# EAGLE design AND gate (EAGLE 6.5.0)
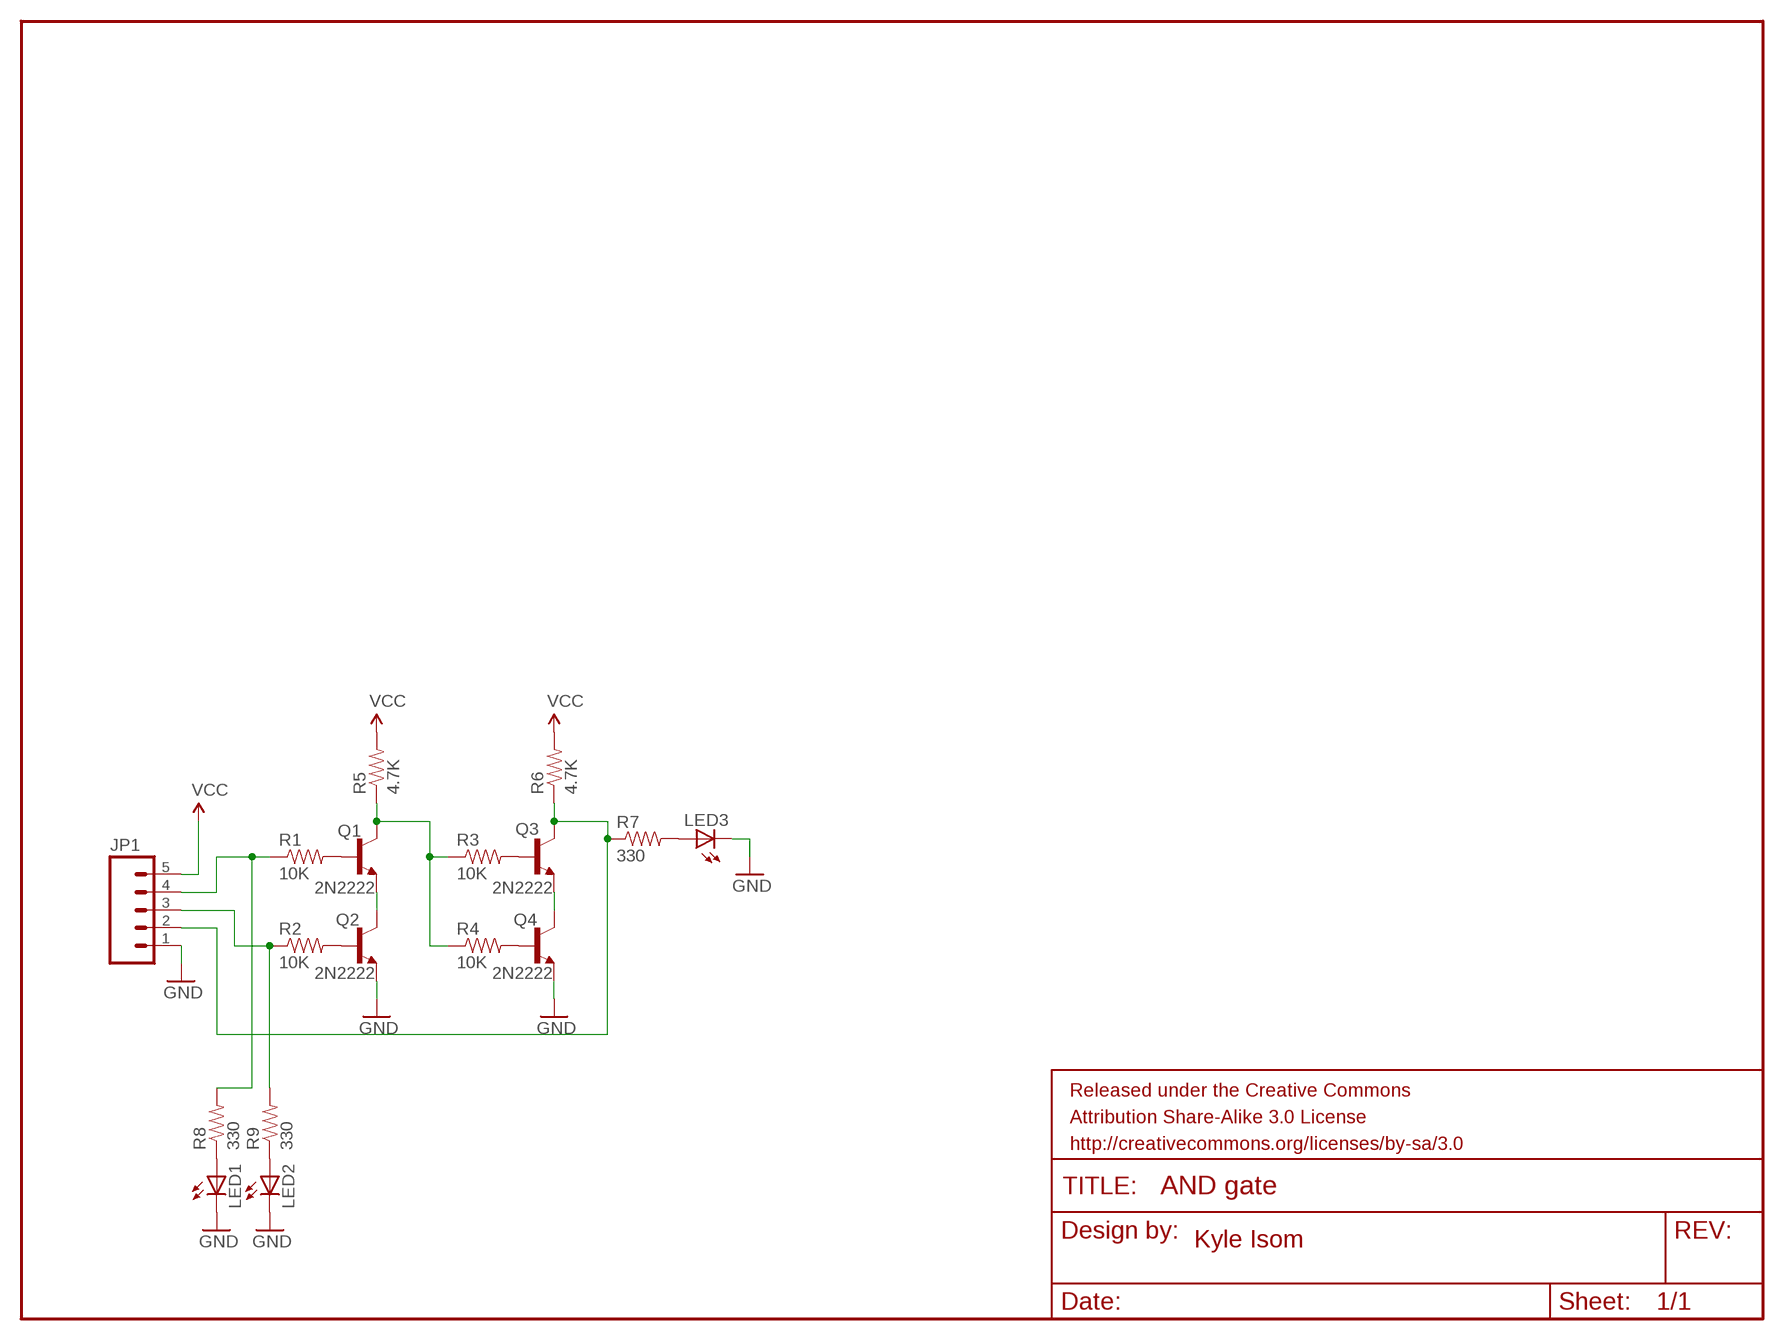
[diagram p0: schematic, sheet 1]

## Parts
FRAME1  FRAME-LETTER  [CREATIVE_COMMONS]
JP1  M05LOCK  [1X05_LOCK]
LED1  LED3MM  [LED3MM]
LED2  LED3MM  [LED3MM]
LED3  LED3MM  [LED3MM]
Q1  2N2222  TRANSISTOR_NPNTO-92-AMMO  [TO-92-AMMO]
Q2  2N2222  TRANSISTOR_NPNTO-92-AMMO  [TO-92-AMMO]
Q3  2N2222  TRANSISTOR_NPNTO-92-AMMO  [TO-92-AMMO]
Q4  2N2222  TRANSISTOR_NPNTO-92-AMMO  [TO-92-AMMO]
R1  10K  RESISTORPTH-1/4W  [AXIAL-0.4]
R2  10K  RESISTORPTH-1/4W  [AXIAL-0.4]
R3  10K  RESISTORPTH-1/4W  [AXIAL-0.4]
R4  10K  RESISTORPTH-1/4W  [AXIAL-0.4]
R5  4.7K  RESISTORPTH-1/4W  [AXIAL-0.4]
R6  4.7K  RESISTORPTH-1/4W  [AXIAL-0.4]
R7  330  RESISTORPTH-1/4W  [AXIAL-0.4]
R8  330  RESISTORPTH-1/4W  [AXIAL-0.4]
R9  330  RESISTORPTH-1/4W  [AXIAL-0.4]

## Nets
GND: JP1.1 LED1.K(C) LED2.K(C) LED3.K(C) Q2.1(E) Q4.1(E)
N$1: Q1.2(B) R1.P$2
N$2: Q2.2(B) R2.P$2
N$3: Q3.2(B) R3.P$2
N$4: Q4.2(B) R4.P$2
N$6: JP1.2 Q3.3(C) R6.P$1 R7.P$1
N$7: JP1.4 R1.P$1 R8.P$2
N$8: JP1.3 R2.P$1 R9.P$2
N$9: Q1.3(C) R3.P$1 R4.P$1 R5.P$1
N$10: Q1.1(E) Q2.3(C)
N$11: Q3.1(E) Q4.3(C)
N$13: LED3.A R7.P$2
N$14: LED1.A R8.P$1
N$15: LED2.A R9.P$1
VCC: JP1.5 R5.P$2 R6.P$2

## Notes on the sheet
- Kyle Isom

## Library data of the parts
FRAME1 = SparkFun-Aesthetics:FRAME-LETTER: Schematic Frame Standard 8.5x11 US Letter frame
JP1 = SparkFun-Connectors:M05: Header 5 Standard 5-pin 0.1" header. Use with straight break away headers (SKU : PRT-00116), right angle break away headers (PRT-00553), swiss pins (PRT-00743), machine pins (PRT-00117), and female headers (PRT-00115). Molex polarized connector foot print use with SKU : PRT-08230 with associated crimp pins and housings.
LED1-LED3 = SparkFun-LED:LED: LEDs Standard schematic elements and footprints for 5mm, 3mm, 1206, and 0603 sized LEDs. 5mm - Spark Fun Electronics SKU : COM-00529 (and others)
Q1-Q4 = SparkFun-DiscreteSemi:TRANSISTOR_NPN: Generic NPN BJT MMBT2222A - TRANS-08049 (SOT-23, 1A 40V) MPSA42 - TRANS-09116 (SOT-23, 500mA 300V) MMBT5088LT1G - TRANS-11160 (SOT-23, 50 mA 30V)
R1-R9 = SparkFun-Passives:RESISTOR: Resistor Basic schematic elements and footprints for 0603, 1206, and PTH resistors.

## Board
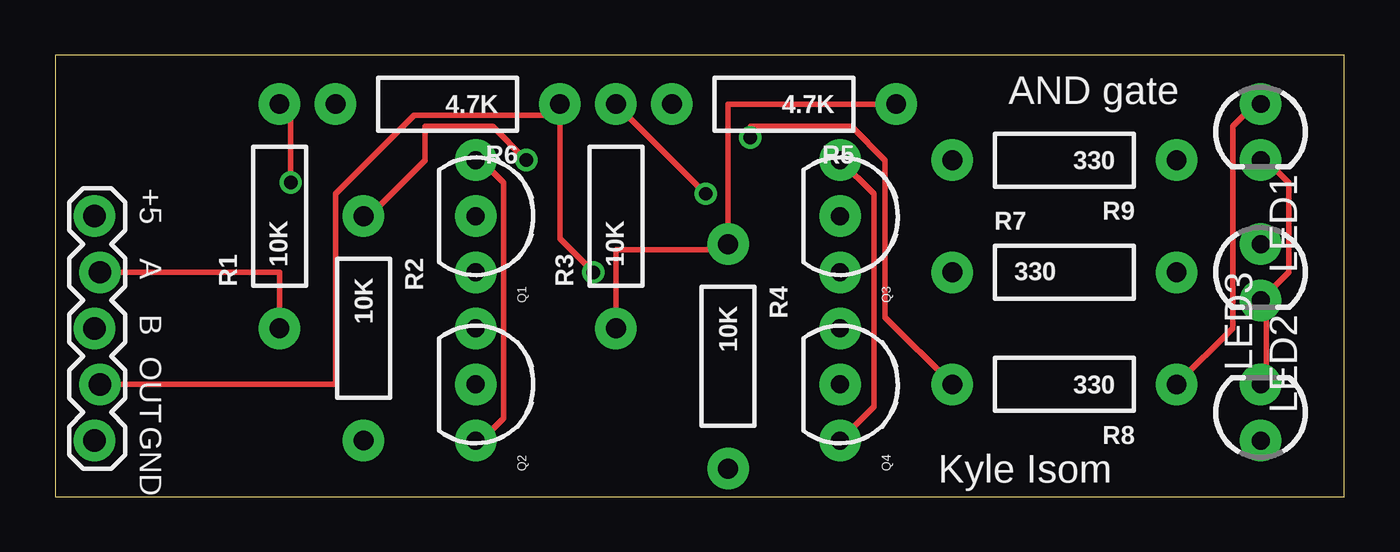
[diagram p1: board, top side]
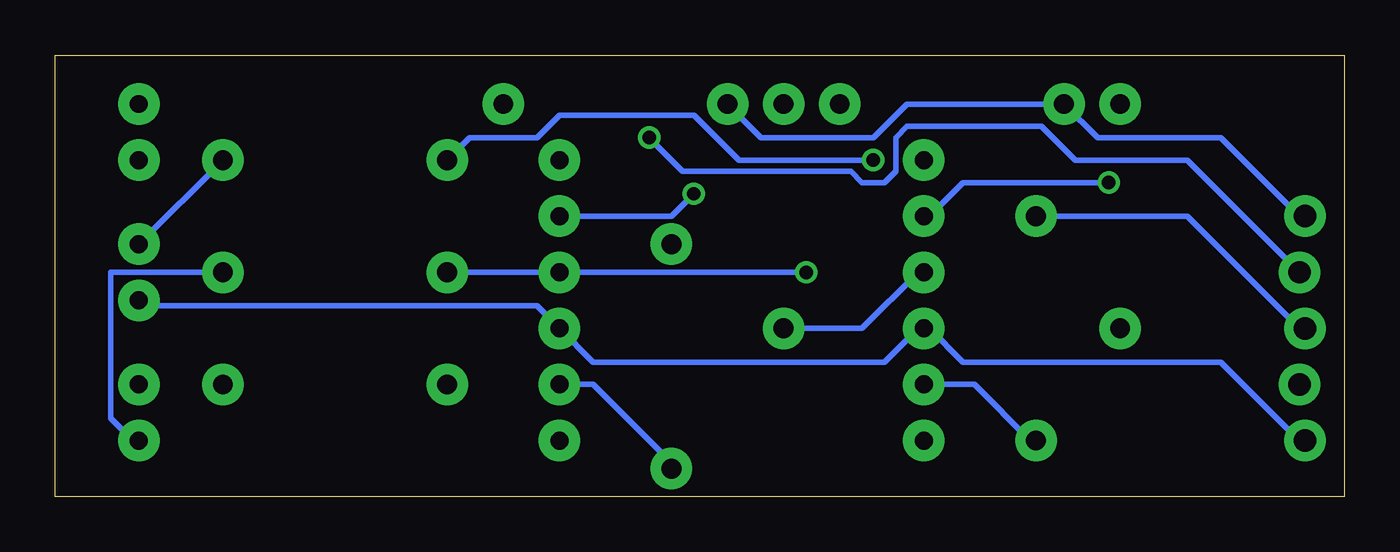
[diagram p2: board, bottom side, seen from below]

Size 58.4 x 19.99 mm. Coordinates in mm from the lower left corner, seen from the top.
Outline: 0,0 58.4,0 58.4,19.99 0,19.99 0,0
Copper layers (1*16): Top 0.035mm / dielectric 1.5mm / Bottom 0.035mm
Design rules "default": minimum track width 10mil, minimum drill 24mil, track to track 8mil, track to pad 8mil, pad to pad 8mil, via to via 8mil, smd to smd 8mil, copper to edge 40mil, drill to drill 8mil, minimum pad ring 10mil, minimum via ring 8mil, stop-mask expansion 4mil, vias tented up to drill 0mil, thermal gap 10mil

### Footprints (pad centres in the part's own frame; a part is rotated, then mirrored left to right if it is on the bottom)
1X05_LOCK = drill 1.016 pad 1.88: 1 0,0.127; 2 2.54,-0.127; 3 5.08,0.127; 4 7.62,-0.127; 5 10.16,0.127
LED3MM = drill 0.813 pad 1.88: A -1.27,0; K 1.27,0
TO-92-AMMO = drill 0.813 pad 1.88: 1 -2.54,0; 2 0,0; 3 2.54,0
AXIAL-0.4 = drill 0.9 pad 1.88: P$1 -5.08,0; P$2 5.08,0

### Placement (x,y rotation side)
FRAME1  21.59,-8.89 0 top  (outside the outline)
JP1  1.91,2.54 90 top
LED1  54.61,16.51 270 top
LED2  54.61,10.16 270 top
LED3  54.61,3.81 90 top
Q1  19.05,12.7 270 top
Q2  19.05,5.08 270 top
Q3  35.56,12.7 270 top
Q4  35.56,5.08 270 top
R1  10.16,12.7 90 top
R2  13.97,7.62 270 top
R3  25.4,12.7 90 top
R4  30.48,6.35 270 top
R5  33.02,17.78 180 top
R6  17.78,17.78 180 top
R7  45.72,10.16 0 top
R8  45.72,5.08 180 top
R9  45.72,15.24 180 top

### Tracks (layer width: path | path; a pad name or v marks a point on that pad's centre or on a via)
GND
  Top 0.254: LED3.K 54.86,5.08 54.86,8.64 LED2.K 55.88,10.16 55.88,14.22 54.86,15.24 LED1.K
  Bottom 0.254: LED2.K 54.36,8.64 36.58,8.64 Q4.1 34.04,6.1 20.83,6.1 19.3,7.62 Q2.1 18.8,7.62 17.27,6.1 5.59,6.1 2.03,2.54 JP1.1
N$1  (via drill 0.61)
  Top 0.254: R1.P$2 10.67,17.27 v10.67,14.22
  Bottom 0.254: v10.67,14.22 17.27,14.22 18.8,12.7 Q1.2
N$2
  Bottom 0.254: Q2.2 16.76,5.08 14.22,2.54 R2.P$2
N$3  (via drill 0.61)
  Top 0.254: v29.46,13.72 R3.P$2
  Bottom 0.254: v29.46,13.72 30.48,12.7 Q3.2
N$4
  Bottom 0.254: Q4.2 34.04,5.08 30.48,1.52 R4.P$2
N$6  (via drill 0.61)
  Top 0.254: v24.38,10.16 22.86,11.68 22.86,17.27 | JP1.2 12.7,5.08 12.7,13.72 16.26,17.27 22.86,17.27 | 22.86,17.27 R6.P$1
  Bottom 0.254: R7.P$1 Q3.3 v24.38,10.16
N$7  (via drill 0.61)
  Top 0.254: JP1.4 10.16,10.16 R1.P$1 | R8.P$2 37.59,8.13 37.59,15.24 36.07,16.76 31.5,16.76 v31.5,16.26
  Bottom 0.254: v31.5,16.26 29.97,14.73 22.35,14.73 21.84,14.22 20.83,14.22 20.32,14.73 20.32,16.26 19.81,16.76 13.72,16.76 12.19,15.24 7.11,15.24 JP1.4
N$8  (via drill 0.61)
  Top 0.254: v21.34,15.24 19.81,16.76 16.76,16.76 16.76,15.24 14.22,12.7 R2.P$1
  Bottom 0.254: R2.P$1 7.11,12.7 2.03,7.62 JP1.3 | R9.P$2 39.62,16.26 36.58,16.26 35.56,17.27 29.46,17.27 27.43,15.24 v21.34,15.24
N$9
  Top 0.254: R3.P$1 25.4,11.18 30.48,11.18 R4.P$1 30.48,17.78 R5.P$1
  Bottom 0.254: R3.P$1 21.84,7.62 19.3,10.16 Q1.3
N$10
  Top 0.254: Q2.3 19.3,2.54 20.32,3.56 20.32,14.22 19.3,15.24 Q1.1
N$11
  Top 0.254: Q4.3 37.08,4.06 37.08,13.72 Q3.1
N$13
  Bottom 0.254: R7.P$2 55.88,10.16 55.88,3.56 54.86,2.54 LED3.A
N$14
  Top 0.254: R8.P$1 53.34,7.62 53.34,16.76 54.36,17.78 LED1.A
N$15
  Bottom 0.254: R9.P$1 LED2.A
VCC
  Bottom 0.254: R5.P$2 26.42,16.26 21.34,16.26 19.81,17.78 R6.P$2 11.18,16.26 5.59,16.26 2.03,12.7 JP1.5

### Text on the board
tPlace: AND gate | +5 | A | B | OUT | GND | Kyle Isom